# Altium schematic sheet ldo.SchDoc
size A4; SheetNumber: 2; SheetTotal: 9
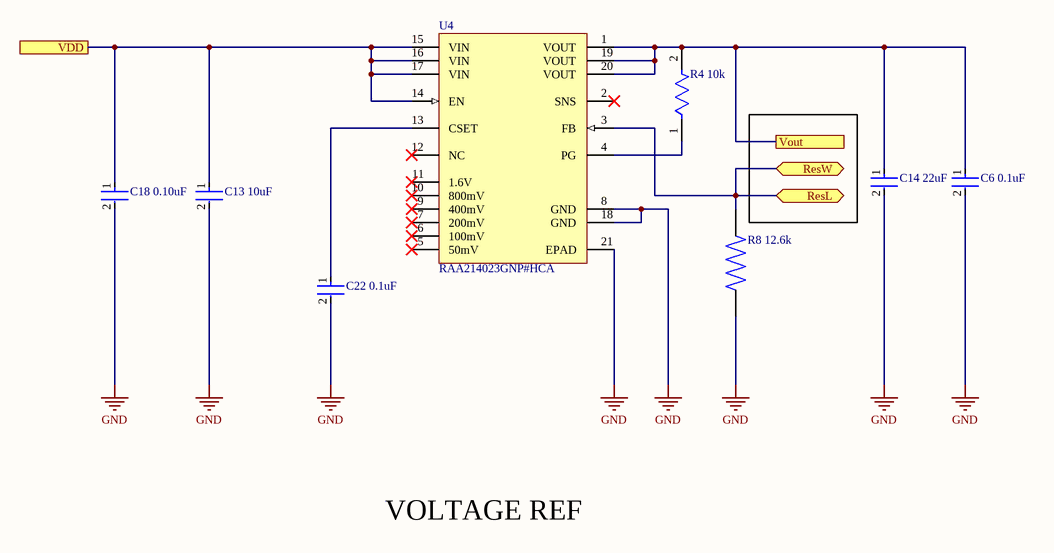
[diagram p0: ldo.SchDoc]

## Parts
C6_0.1uF  C0805C104K4RAC  [FP-C0805C-DN-MFG]  (value not drawn)
C13_10uF  CL21A106KOQNNNG  [FP-CL21-IPC_C]  (value not drawn)
C14_22uF  CL21A226MOCLRNC  [FP-CL21-IPC_C]  (value not drawn)
C18_0.10uF  C0805C104K4RAC  [FP-C0805C-DN-MFG]  (value not drawn)
C22_0.1uF  C0805C104K4RAC  [FP-C0805C-DN-MFG]  (value not drawn)
R4_10k  RC1005F103CS  [FP-RC1005-IPC_B]  (value not drawn)
R8_12.6k  RN73R1ETTP1262B25  [RESC1005X40N]  (value not drawn)
U4  RAA214023GNP#HCA  [L20_3_5x3_5_MFG]

## Ports
ResL (bidir, see THE_FIRST[8G]), ResW (bidir, see THE_FIRST[8G]), VDD (see THE_FIRST[9G], DP10[1B], DP[2B], ldo1.1[1B], LDO3.3[1B], lm334sm[2B]), Vout (see THE_FIRST[8G])

## Nets
GND: C6_0.1uF.2 C13_10uF.2 C14_22uF.2 C18_0.10uF.2 C22_0.1uF.2 R8_12.6k.1 U4.8(GND) U4.18(GND) U4.21(EPAD)
ResL: R8_12.6k.2 U4.3(FB) ; port ResW, port ResL
VDD: C13_10uF.1 C18_0.10uF.1 U4.14(EN) U4.15(VIN) U4.16(VIN) U4.17(VIN) ; port VDD
Vout: C6_0.1uF.1 C14_22uF.1 R4_10k.2 U4.1(VOUT) U4.19(VOUT) U4.20(VOUT) ; port Vout
NetC22_0.1uF_1: C22_0.1uF.1 U4.13(CSET)
NetR4_10k_1: R4_10k.1 U4.4(PG)

Not connected (* = marked no-connect by the designer): U4 2(SNS)* 5(50mV)* 6(100mV)* 7(200mV)* 9(400mV)* 10(800mV)* 11(1.6V)* 12(NC)*

## Notes on the sheet
- VOLTAGE REF

## Library data of the parts
C6_0.1uF C18_0.10uF C22_0.1uF = CMP-03020-009592-2: C0805 0.10 μF X7R 30ppm/°C 10.00% 16 V; Manufacturer: KEMET; Material: Ceramic; Capacitance: 0.10 μF; Tolerance: 0.1; Value: 0.10 μF; Voltage Rating: 16 V; ComponentLink2Description: Datasheet; Category: Cap; Package: C0805C-DN; Device Class L1: Passive Components; Device Class L3: Ceramic Capacitors; RoHS: TRUE; Height: 0.88mm; Automotive: No; Temperature Range High: +125°C; Octopart: https://octopart.com/c0805c104k4rac-kemet-1343167; Mouser Description: Cap Ceramic 0.1uF 16V X7R 10% Pad SMD 0805 125C Bulk; Lead Free: Yes; Temperature Coefficient: 30ppm/°C; Ipc Land Pattern Name: CAPC200125X78; Manufacturer Part Number: C0805C104K4RAC; Temperature Characteristic: X7R; Device Class L2: Capacitors; Temperature Range Low: -55°C; Temperature: -55°C to +125°C; ComponentLink2URL: https://content.kemet.com/datasheets/KEM_C1003_C0G_SMD.pdf
C13_10uF = CMP-13271-002240-1: CL21 Series 0805 10uF 16V ±10% Tolerance X5R Multilayer Ceramic Chip Capacitor; Capacitance: 10uF; Case Code (Metric): 2012; Package Quantity: 3000; Width: 0.049inch; Mount: Surface Mount; Depth: 1.25mm; Material: Ceramic; Min Operating Temperature: -55°C; Thickness: 0.053inch; Tolerance: 10%; Case Code (Imperial): 0805; Packaging: Tape and Reel; Voltage Rating: 16V; Case/Package: 0805; Height: 1.25mm; Voltage: 16V; Max Operating Temperature: 85°C; Length: 2mm; Dielectric: X5R
C14_22uF = CMP-13271-002990-1: CL21 Series 0805 22uF 16V ±20% Tolerance X5R Multilayer Ceramic Chip Capacitor; Case Code (Imperial): 0805; Capacitance: 22uF; Max Operating Temperature: 85°C; Min Operating Temperature: -55°C; Packaging: Tape and Reel; Case Code (Metric): 2012; Case/Package: 0805; Mount: Surface Mount; Tolerance: 20%; Thickness: 0.037inch; Voltage Rating: 16V; Width: 0.049inch; Length: 0.079inch
R4_10k = CMP-13261-004522-1: Res Thick Film 0402 10kΩ 1% 0.063W ±100ppm/°C Molded SMD T/R; Max Power Dissipation: 63mW; Resistance: 10kR; Power Rating: 62.5mW; Package Quantity: 1; Depth: 0.5mm; Radiation Hardening: No; Features: Moisture Resistant; Max Operating Temperature: 155°C; Case Code (Metric): 1005; Military Standard: Not; Case/Package: 0402; Width: 0.02inch; Contact Plating: Tin; Mount: Surface Mount; Packaging: Tape and Reel; Height: 0.016inch; Case Code (Imperial): 0402; Number of Terminations: 2; Composition: Thick Film; Temperature Coefficient: 100ppm/°C; Min Operating Temperature: -55°C; Tolerance: 1%; Length: 1mm
R8_12.6k = RN73R1ETTP1262B25: Fixed Resistor, Thin Film, 0.063W, 12600ohm, 50V, 0.1% +/-Tol, 25ppm/Cel, Surface Mount, 0402; Manufacturer: KOA Speer; Package: None; Price: None; Value: *; MP: RN73R1ETTP1262B25; Availability: Unavailable; Supplier: Digikey; Supplier Part Number: 2019-RN73R1ETTP1262B25CT-ND; Manufacturer Part Number: RN73R1ETTP1262B25; RoHS: Yes; Category: Chip SMD Resistors; Stock: 8327; Pricing: 1=0.1, 10=0.066, 50=0.0576, 100=0.0544, 500=0.04774, 1000=0.04524, 5000=0.04032 (USD)
U4 = CMP-00572-126438255-2: LDO Voltage Regulators 2A Low Noise LDO, 20 Lead 3.5x3.5 QFN (NiPdAu-Ag lead finish; Manufacturer Lifecycle Status: ACTIVE; Manufacturer: Renesas; Min Output Voltage: 5V; Max Junction Temperature (Tj): 150°C; Dropout Voltage: 420mV; Max Supply Voltage: 5.5V; Output Voltage: 800mV; Quiescent Current: 195µA; Min Supply Voltage: 2.7V; RAM Size: 1.5kB; Pitch: 500µm; Package Body Material: Plastic; Adjustability: ADJUSTABLE; Dropout Voltage1-Max: 570mV; Channels: 1; Output Voltage1-Max: 4.93V; Regulator Type: ADJUSTABLE POSITIVE SINGLE OUTPUT LDO REGULATOR; Case/Package: QFN; Width: 3.5mm; ComponentLink3Description: Manufacturer's Package Drawing; ComponentLink1Description: Manufacturer's Website; HelpURL: https://octopart.com/cad-content/api/get-model-datasheet/15189/126438255; ComponentLink3URL: https://www.renesas.com/en/document/psc/l2035x35-20-lead-quad-flat-no-lead-package-qfn; Height: 900µm; Max Operating Temperature: 85°C; Number of Pins: 20; Max Output Current: 2A; Max Input Voltage: 5.5V; Length: 3.5mm; ComponentLink2URL: https://octopart.com/cad-content/api/get-model-datasheet/15189/126438255; ComponentLink2Description: Datasheet URL; Min Input Voltage: 2.7V; Mount: Surface Mount; Max Output Voltage: 800mV; RoHS: Compliant; ComponentLink1URL: http://www.renesas.com; Min Operating Temperature: -40°C; Lifecycle Status: Production; Supplier: Mouser; Supplier Part Number: 968-RAA214023GNP#HCA; Manufacturer Part Number: RAA214023GNP#HCA; Stock: 3715; Pricing: 1=4.26, 10=2.76, 50=2.36, 100=1.92, 1000=1.45, 10000=1.43 (USD); Mounting Technology: Surface Mount; Pins: 20; Package Shape: Square; Terminal Finish: Gold; Dropout Voltage1-Nom: 420mV; Moisture Sensitivity Level: 1; Number of Outputs: 1; Output Current1-Max: 2A; Output Voltage1-Min: 800mV; Packaging: Tape and Reel; Surface Mount: Yes; Terminal Form: No Lead; Terminal Position: QUAD; Height - Seated (Max): 0.9mm; Terminal Pitch: 0.5mm; Reach SVHC Compliant: Yes; RoHS Compliant: Yes; ComponentLink4URL: https://datasheet.ciiva.com:443/pdfs/VipMasterIC/IC/RNCC/RNCC-S-A0011343211/RNCC-S-A0014920273-1.pdf?src-supplier=IHS+Markit; ComponentLink4Description: https://datasheet.ciiva.com:443/pdfs/VipMasterIC/IC/RNCC/RNCC-S-A0011343211/RNCC-S-A0014920273-1.pdf?src-supplier=IHS+Markit